# EAGLE design billdetector1c (EAGLE 5.11)
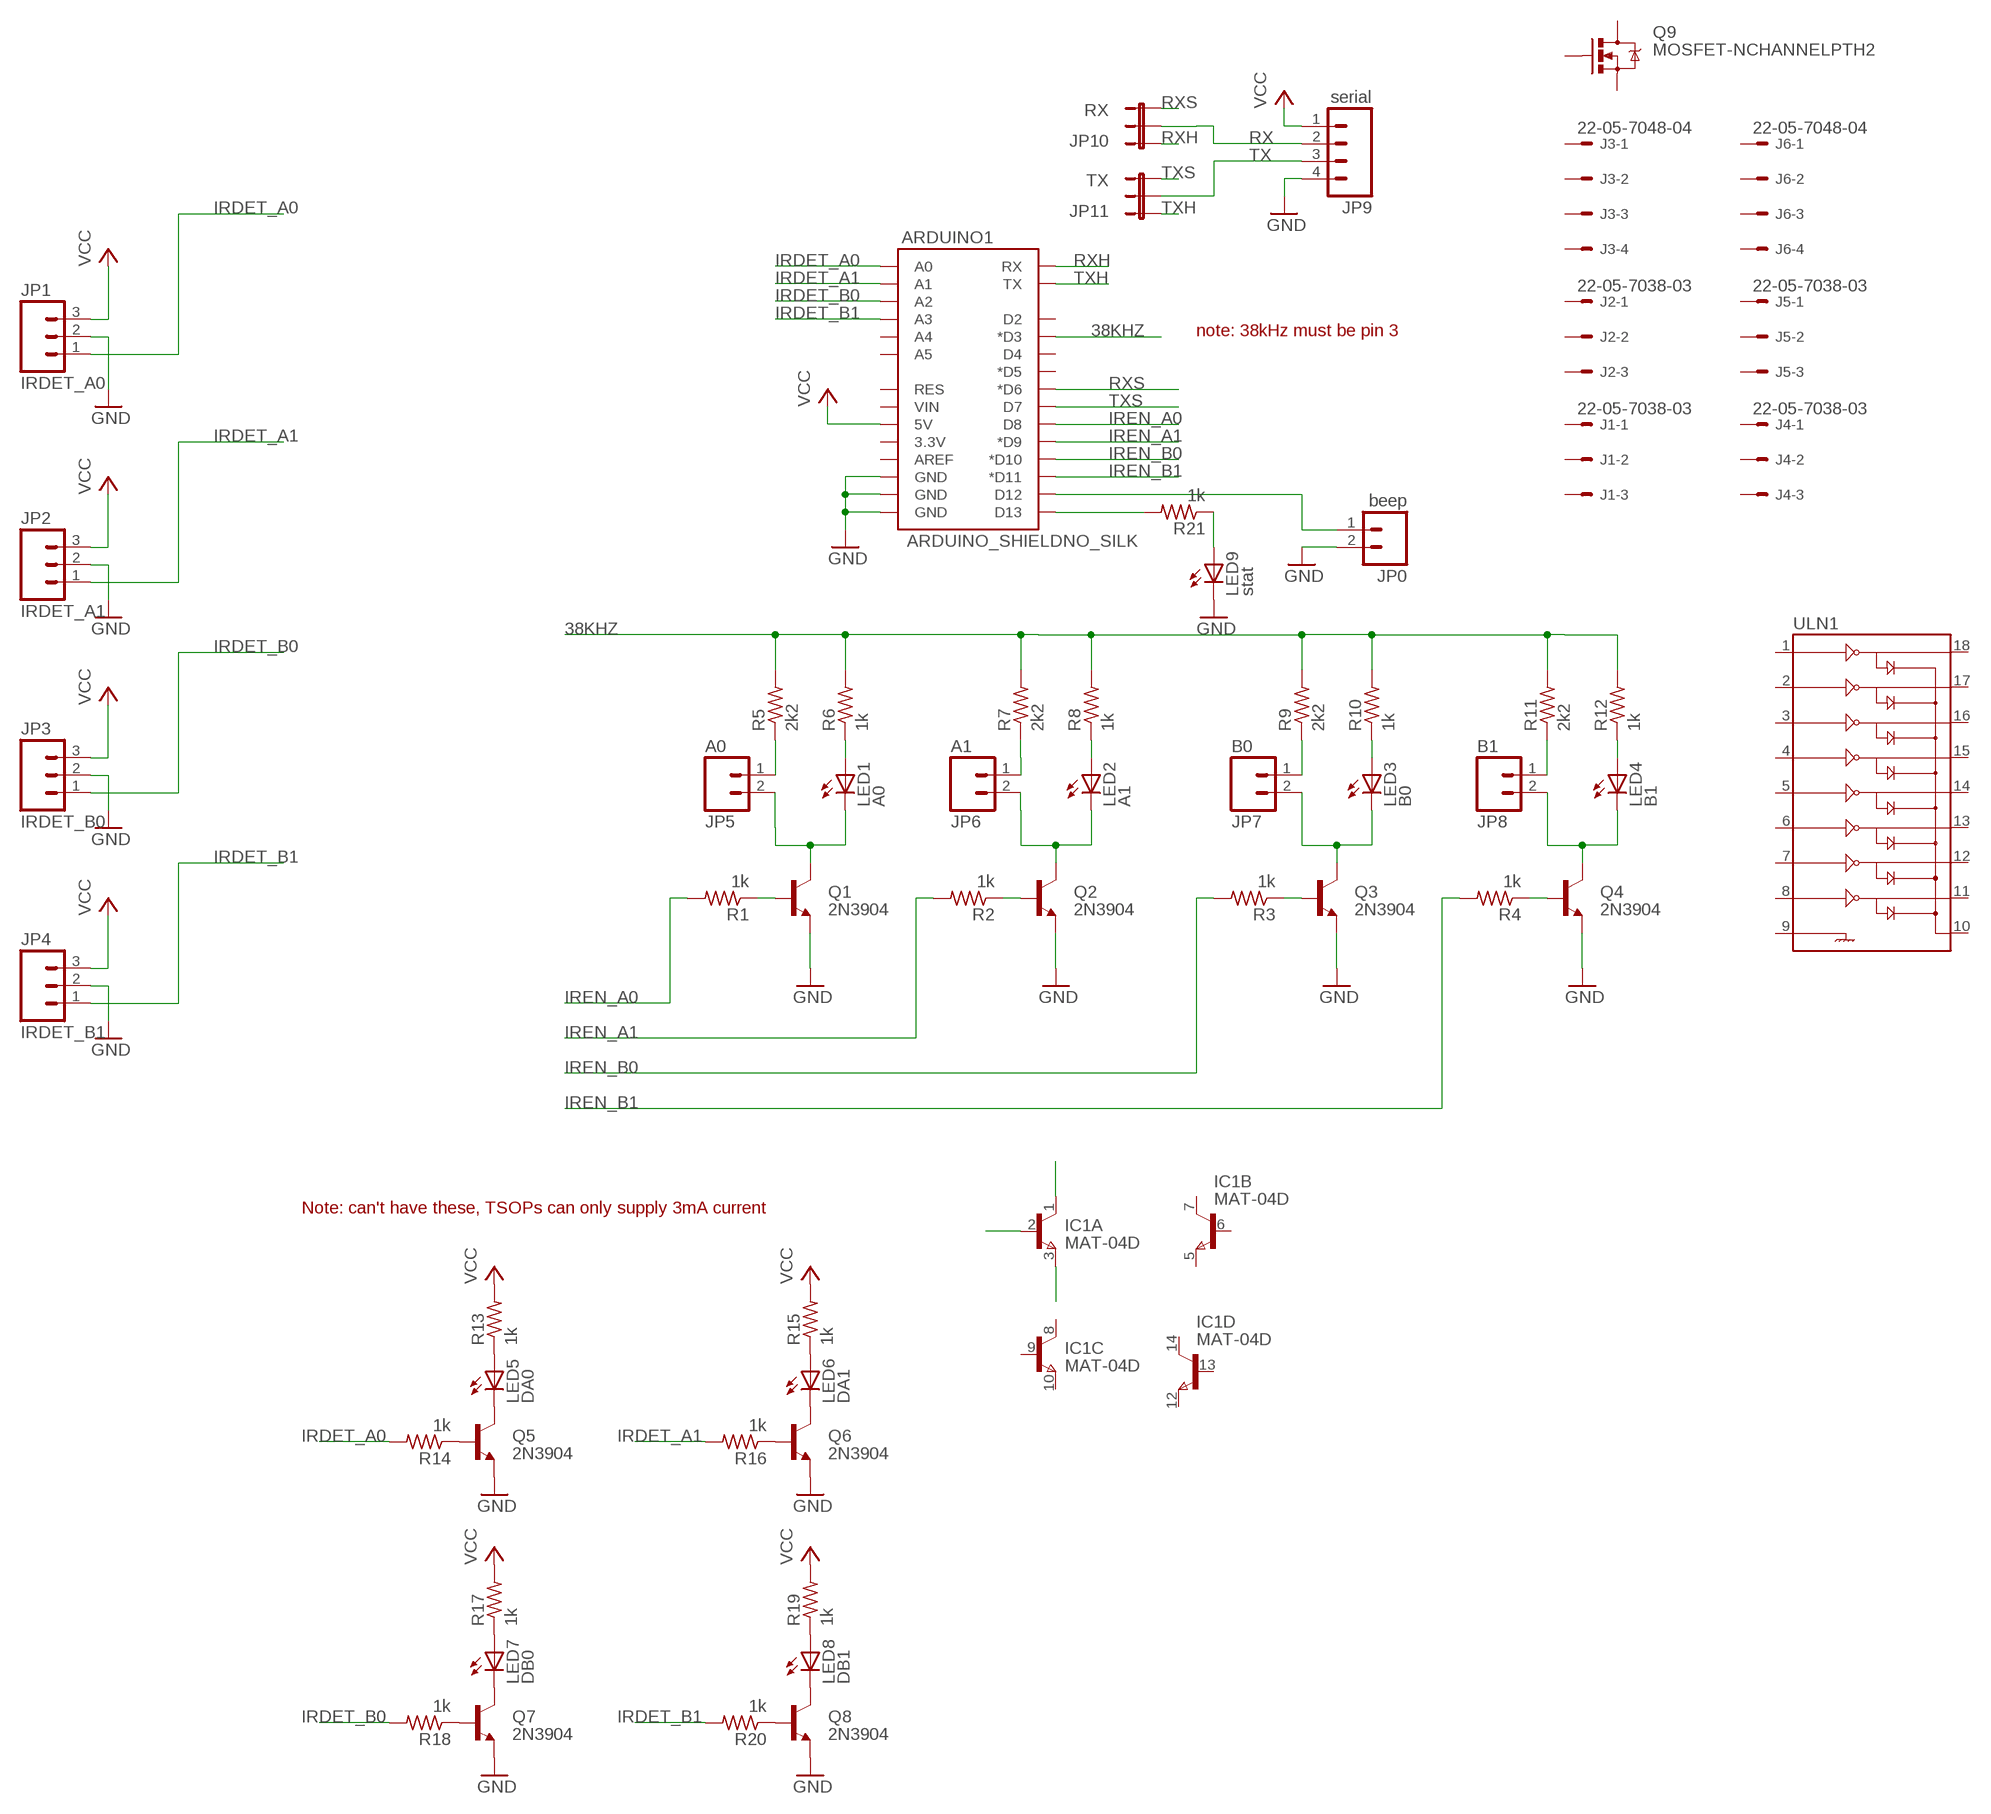
[diagram p0: schematic, sheet 1]

## Parts
ARDUINO1  ARDUINO_SHIELDNO_SILK  [DUEMILANOVE_VIAS]
IC1  MAT-04D  [SO14]
J1  22-05-7038-03  [7395-03]
J2  22-05-7038-03  [7395-03]
J3  22-05-7048-04  [7395-04]
J4  22-05-7038-03  [7395-03]
J5  22-05-7038-03  [7395-03]
J6  22-05-7048-04  [7395-04]
JP0  beep  M02LOCK  [1X02_LOCK]
JP1  IRDET_A0  M03POLAR_LOCK  [MOLEX-1X3_LOCK]
JP2  IRDET_A1  M03POLAR_LOCK  [MOLEX-1X3_LOCK]
JP3  IRDET_B0  M03POLAR_LOCK  [MOLEX-1X3_LOCK]
JP4  IRDET_B1  M03POLAR_LOCK  [MOLEX-1X3_LOCK]
JP5  A0  M02POLAR_LOCK  [MOLEX-1X2_LOCK]
JP6  A1  M02POLAR_LOCK  [MOLEX-1X2_LOCK]
JP7  B0  M02POLAR_LOCK  [MOLEX-1X2_LOCK]
JP8  B1  M02POLAR_LOCK  [MOLEX-1X2_LOCK]
JP9  serial  M04POLAR_LOCK  [MOLEX-1X4_LOCK]
JP10  RX  JUMPER-3PTH  [1X03]
JP11  TX  JUMPER-3PTH  [1X03]
LED1  A0  LED3MM  [LED3MM]
LED2  A1  LED3MM  [LED3MM]
LED3  B0  LED3MM  [LED3MM]
LED4  B1  LED3MM  [LED3MM]
LED5  DA0  LED3MM  [LED3MM]
LED6  DA1  LED3MM  [LED3MM]
LED7  DB0  LED3MM  [LED3MM]
LED8  DB1  LED3MM  [LED3MM]
LED9  stat  LED3MM  [LED3MM]
Q1  2N3904  TRANSISTOR_NPNTO92  [TO-92]
Q2  2N3904  TRANSISTOR_NPNTO92  [TO-92]
Q3  2N3904  TRANSISTOR_NPNTO92  [TO-92]
Q4  2N3904  TRANSISTOR_NPNTO92  [TO-92]
Q5  2N3904  TRANSISTOR_NPNTO92  [TO-92]
Q6  2N3904  TRANSISTOR_NPNTO92  [TO-92]
Q7  2N3904  TRANSISTOR_NPNTO92  [TO-92]
Q8  2N3904  TRANSISTOR_NPNTO92  [TO-92]
Q9  MOSFET-NCHANNELPTH2  [TO220V]
R1  1k  R-US_0204/5  [0204/5]
R2  1k  R-US_0204/5  [0204/5]
R3  1k  R-US_0204/5  [0204/5]
R4  1k  R-US_0204/5  [0204/5]
R5  2k2  R-US_0204/5  [0204/5]
R6  1k  R-US_0204/5  [0204/5]
R7  2k2  R-US_0204/5  [0204/5]
R8  1k  R-US_0204/5  [0204/5]
R9  2k2  R-US_0204/5  [0204/5]
R10  1k  R-US_0204/5  [0204/5]
R11  2k2  R-US_0204/5  [0204/5]
R12  1k  R-US_0204/5  [0204/5]
R13  1k  R-US_0204/5  [0204/5]
R14  1k  R-US_0204/5  [0204/5]
R15  1k  R-US_0204/5  [0204/5]
R16  1k  R-US_0204/5  [0204/5]
R17  1k  R-US_0204/5  [0204/5]
R18  1k  R-US_0204/5  [0204/5]
R19  1k  R-US_0204/5  [0204/5]
R20  1k  R-US_0204/5  [0204/5]
R21  1k  R-US_0204/5  [0204/5]
ULN1  ULN2803DIP  [DIL18]

## Nets
38KHZ: ARDUINO1.D3(*D3) R5.2 R6.2 R7.2 R8.2 R9.2 R10.2 R11.2 R12.2
GND: ARDUINO1.GND@0(GND) ARDUINO1.GND@1(GND) ARDUINO1.GND@2(GND) JP0.2 JP1.2 JP2.2 JP3.2 JP4.2 JP9.4 LED9.K(C) Q1.1(E) Q2.1(E) Q3.1(E) Q4.1(E) Q5.1(E) Q6.1(E) Q7.1(E) Q8.1(E)
IRDET_A0: ARDUINO1.A0 JP1.1 R14.2
IRDET_A1: ARDUINO1.A1 JP2.1 R16.2
IRDET_B0: ARDUINO1.A2 JP3.1 R18.2
IRDET_B1: ARDUINO1.A3 JP4.1 R20.2
IREN_A0: ARDUINO1.D8 R1.2
IREN_A1: ARDUINO1.D9(*D9) R2.2
IREN_B0: ARDUINO1.D10(*D10) R3.2
IREN_B1: ARDUINO1.D11(*D11) R4.2
N$1: Q3.2(B) R3.1
N$2: Q4.2(B) R4.1
N$3: JP6.1 R7.1
N$4: JP5.2 LED1.K(C) Q1.3(C)
N$5: Q1.2(B) R1.1
N$6: Q2.2(B) R2.1
N$7: ARDUINO1.D12 JP0.1
N$8: ARDUINO1.D13 R21.2
N$9: LED1.A R6.1
N$10: LED2.A R8.1
N$11: JP6.2 LED2.K(C) Q2.3(C)
N$12: LED5.A R13.1
N$13: JP5.1 R5.1
N$14: LED5.K(C) Q5.3(C)
N$15: LED3.A R10.1
N$16: LED4.A R12.1
N$17: JP7.1 R9.1
N$18: JP8.1 R11.1
N$19: JP7.2 LED3.K(C) Q3.3(C)
N$20: JP8.2 LED4.K(C) Q4.3(C)
N$21: Q5.2(B) R14.1
N$22: LED6.A R15.1
N$23: LED6.K(C) Q6.3(C)
N$24: Q6.2(B) R16.1
N$25: LED7.A R17.1
N$26: LED7.K(C) Q7.3(C)
N$27: Q7.2(B) R18.1
N$28: LED8.A R19.1
N$29: LED8.K(C) Q8.3(C)
N$30: Q8.2(B) R20.1
N$31: LED9.A R21.1
N$32: IC1.1(A:C)
N$33: IC1.2(A:B)
N$34: IC1.3(A:E)
RX: JP9.2 JP10.2
RXH: ARDUINO1.RX JP10.1
RXS: ARDUINO1.D6(*D6) JP10.3
TX: JP9.3 JP11.2
TXH: ARDUINO1.TX JP11.1
TXS: ARDUINO1.D7 JP11.3
VCC: ARDUINO1.5V JP1.3 JP2.3 JP3.3 JP4.3 JP9.1 R13.2 R15.2 R17.2 R19.2
Unconnected: ARDUINO1.3.3V ARDUINO1.A4 ARDUINO1.A5 ARDUINO1.AREF ARDUINO1.D2 ARDUINO1.D4 ARDUINO1.D5(*D5) ARDUINO1.RES ARDUINO1.VIN IC1.5(B:E) IC1.6(B:B) IC1.7(B:C) IC1.8(C:C) IC1.9(C:B) IC1.10(C:E) IC1.12(D:E) IC1.13(D:B) IC1.14(D:C) J1.1 J1.2 J1.3 J2.1 J2.2 J2.3 J3.1 J3.2 J3.3 J3.4 J4.1 J4.2 J4.3 J5.1 J5.2 J5.3 J6.1 J6.2 J6.3 J6.4 Q9.1(G) Q9.2(D) Q9.3(S) ULN1.1 ULN1.2 ULN1.3 ULN1.4 ULN1.5 ULN1.6 ULN1.7 ULN1.8 ULN1.9 ULN1.10 ULN1.11 ULN1.12 ULN1.13 ULN1.14 ULN1.15 ULN1.16 ULN1.17 ULN1.18

## Notes on the sheet
- note: 38kHz must be pin 3
- Note: can't have these, TSOPs can only supply 3mA current

## Library data of the parts
ARDUINO1 = SparkFun-20110517:ARDUINO_SHIELD
IC1 = linear:MAT-04: Quad TRANSISTOR
J1 J2 J4 J5 = con-molex:22-?-03: CONNECTOR wire to board 2.54 mm (.1 inch) pitch header; OC_FARNELL: unknown; OC_NEWARK: unknown
J3 J6 = con-molex:22-?-04: CONNECTOR wire to board 2.54 mm (.1 inch) pitch header; OC_FARNELL: unknown; OC_NEWARK: unknown
JP0 JP5-JP8 = SparkFun-20110517:M02: Header 2 Standard 2-pin 0.1" header. Use with straight break away headers (SKU : PRT-00116), right angle break away headers (PRT-00553), swiss pins (PRT-00743), machine pins (PRT-00117), and female headers (PRT-00115). Molex polarized connector foot print use with SKU : PRT-08233 with associated crimp pins and housings.
JP1-JP4 = SparkFun-20110517:M03: Header 3 Standard 3-pin 0.1" header. Use with straight break away headers (SKU : PRT-00116), right angle break away headers (PRT-00553), swiss pins (PRT-00743), machine pins (PRT-00117), and female headers (PRT-00115). Molex polarized connector foot print use with SKU : PRT-08232 with associated crimp pins and housings.
JP9 = SparkFun-20110517:M04: Header 4 Standard 4-pin 0.1" header. Use with straight break away headers (SKU : PRT-00116), right angle break away headers (PRT-00553), swiss pins (PRT-00743), machine pins (PRT-00117), and female headers (PRT-00115). Molex polarized connector foot print use with SKU : PRT-08231 with associated crimp pins and housings. 1MM SMD Version SKU: PRT-10208
JP10 JP11 = SparkFun-20110517:JUMPER-3
LED1-LED9 = SparkFun-20110517:LED: LEDs Standard schematic elements and footprints for 5mm, 3mm, 1206, and 0603 sized LEDs. 5mm - Spark Fun Electronics SKU : COM-00529 (and others)
Q1-Q8 = SparkFun-20110517:TRANSISTOR_NPN: Transistor NPN BJT configuration in SOT23 package. MMBT2222 is the common NPN we use. Double check BCE configuration again layout.
Q9 = SparkFun-20110517:MOSFET-NCHANNEL
R1-R21 = rcl:R-US_: RESISTOR, American symbol
ULN1 = SparkFun-20110517:ULN2803: Darlington Driver ULN2803 Darlington array. 500mA max per channel, 8-channel package. Spark Fun Electronics SKU : COM-00312

## Board
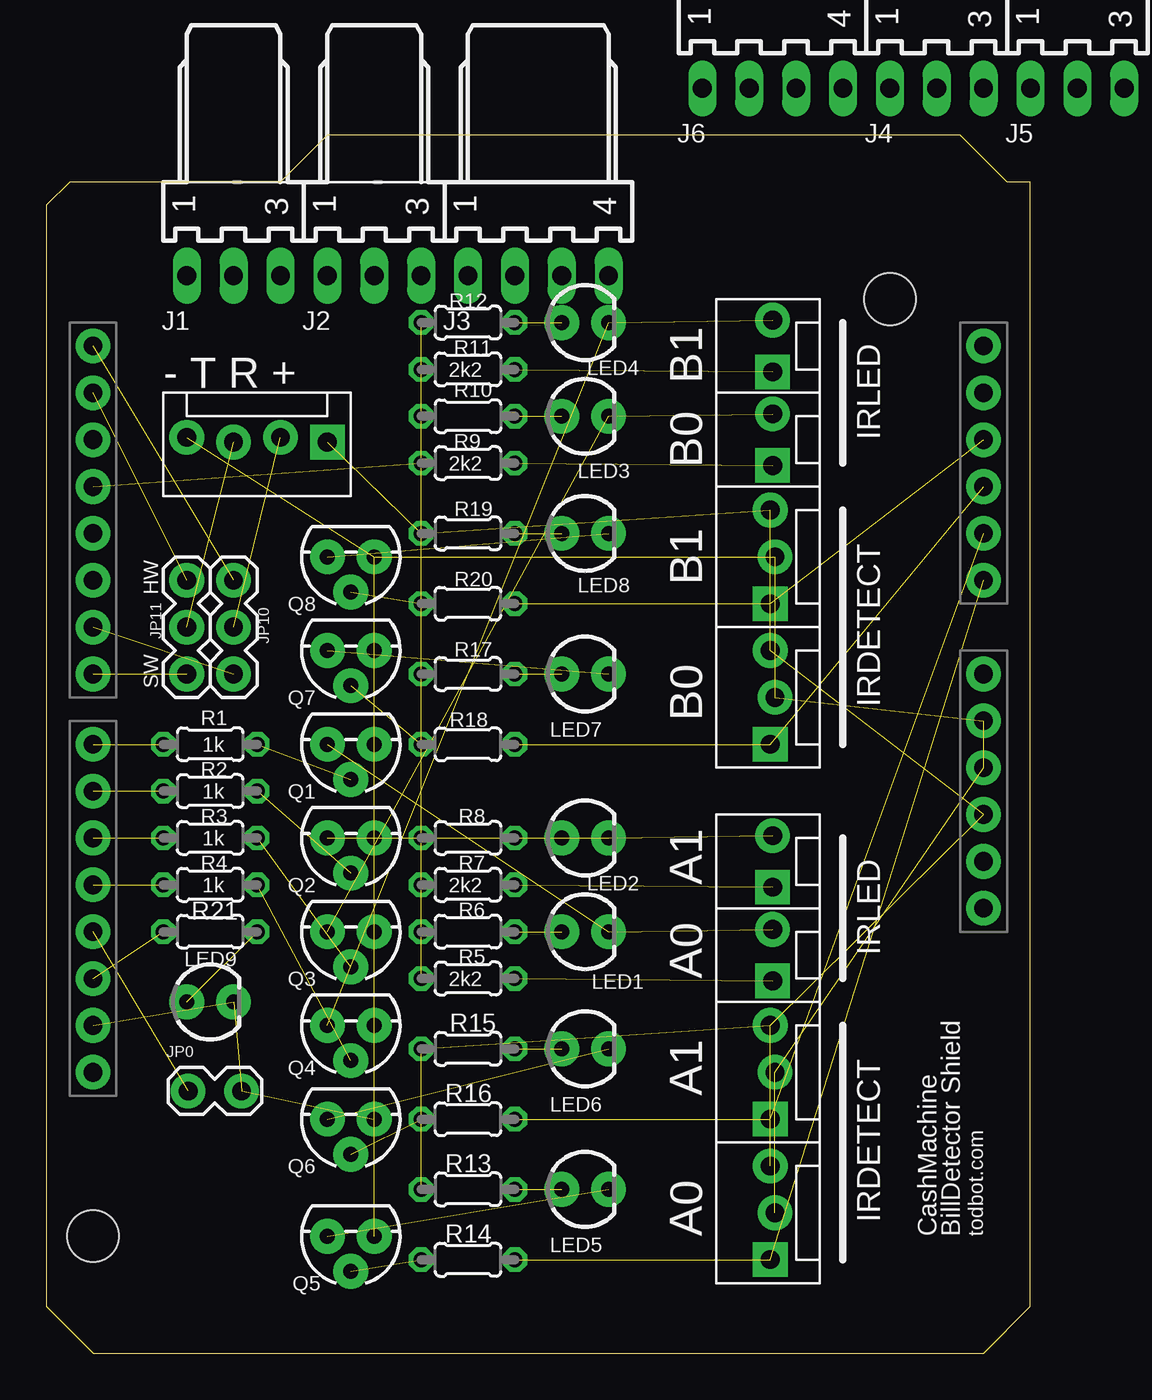
[diagram p1: board, top side]
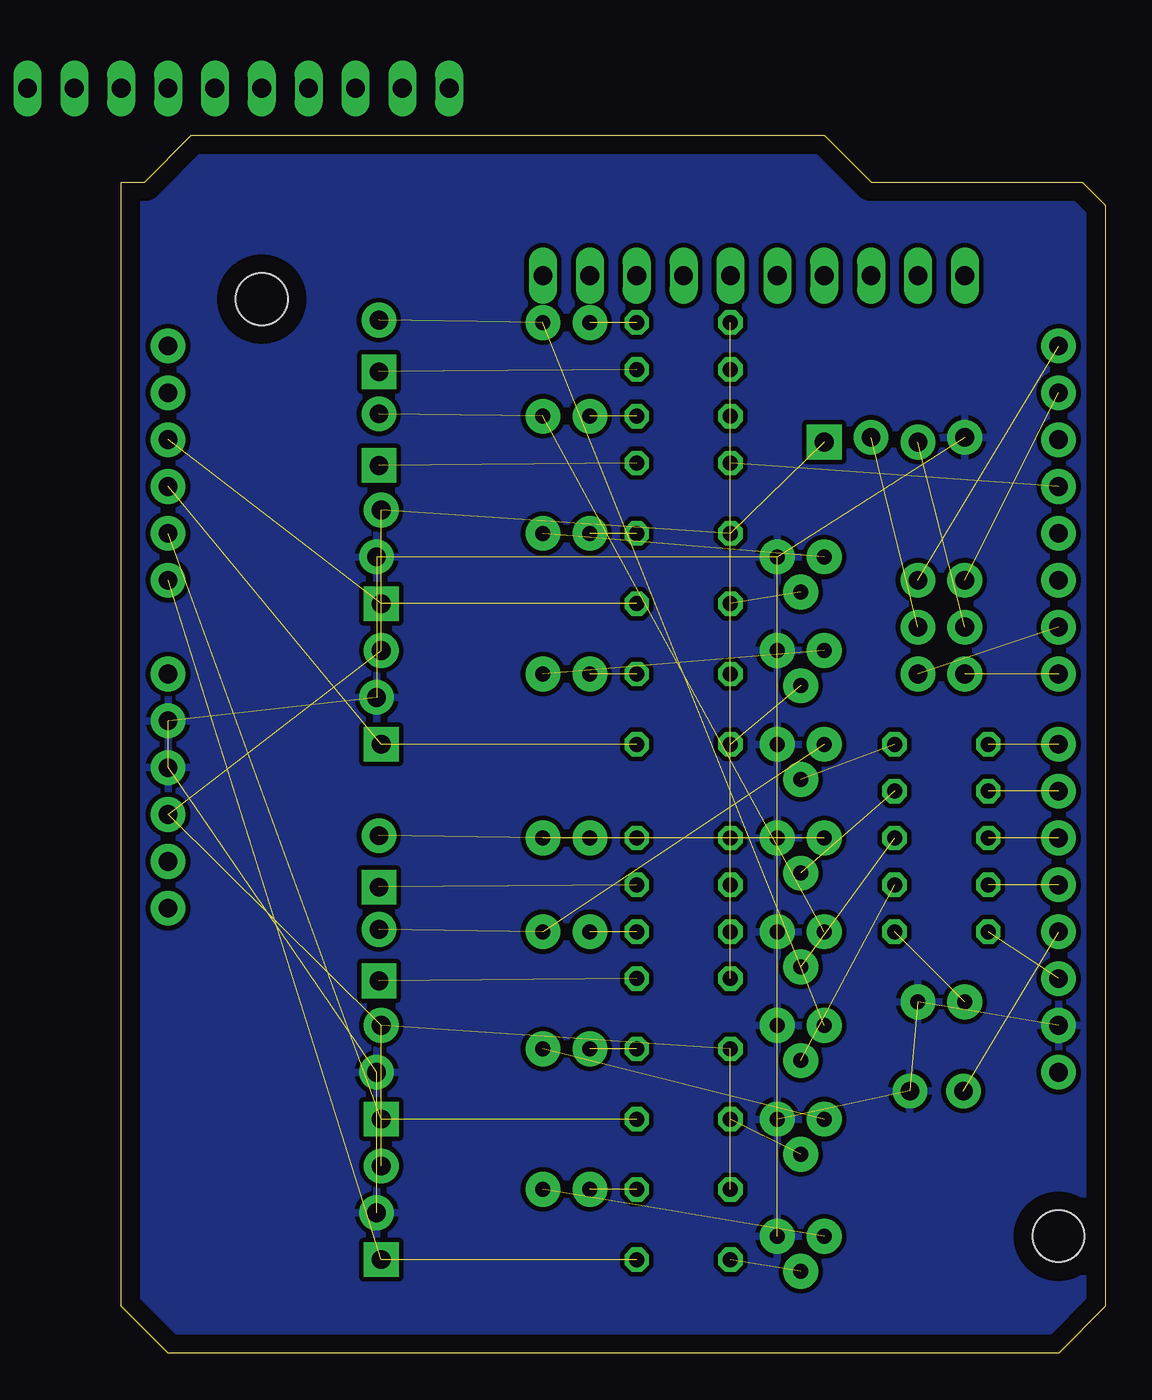
[diagram p2: board, bottom side, seen from below]

Size 53.34 x 66.04 mm. Coordinates in mm from the lower left corner, seen from the top.
Outline: 2.54,0 50.8,0 53.34,2.54 53.34,63.5 52.07,63.5 49.53,66.04 15.24,66.04 12.7,63.5 1.27,63.5 0,62.23 0,2.54 2.54,0
Copper layers (1*16): Top 0.035mm / dielectric 1.5mm / Bottom 0.035mm
Design rules "default *": minimum track width 10mil, minimum drill 24mil, track to track 10mil, track to pad 10mil, pad to pad 10mil, via to via 10mil, smd to smd 8mil, copper to edge 40mil, drill to drill 8mil, minimum pad ring 10mil, minimum via ring 8mil, stop-mask expansion 4mil, vias tented up to drill 0mil, thermal gap 10mil
Holes 2.8 mm at 45.72,57.15 2.54,6.35

### Footprints (pad centres in the part's own frame; a part is rotated, then mirrored left to right if it is on the bottom)
DUEMILANOVE_VIAS = drill 1.016 pad 1.88 round: 3.3V 50.8,13.97; 5V 50.8,16.51; A0 50.8,29.21; A1 50.8,31.75; A2 50.8,34.29; A3 50.8,36.83; A4 50.8,39.37; A5 50.8,41.91; AREF 2.54,2.54; D2 2.54,36.83; D3 2.54,34.29; D4 2.54,31.75; D5 2.54,29.21; D6 2.54,26.67; D7 2.54,24.13; D8 2.54,20.32; D9 2.54,17.78; D10 2.54,15.24; D11 2.54,12.7; D12 2.54,10.16; D13 2.54,7.62; GND@0 50.8,19.05; GND@1 50.8,21.59; GND@2 2.54,5.08; RES 50.8,11.43; RX 2.54,41.91; TX 2.54,39.37; VIN 50.8,24.13
SO14 = smd 0.6 x 2.2: 1 -3.81,-2.6; 2 -2.54,-2.6; 3 -1.27,-2.6; 4 0,-2.6; 5 1.27,-2.6; 6 2.54,-2.6; 7 3.81,-2.6; 8 3.81,2.6; 9 2.54,2.6; 10 1.27,2.6; 11 0,2.6; 12 -1.27,2.6; 13 -2.54,2.6; 14 -3.81,2.6
7395-03 = drill 1.016 long: 1 2.54,0; 2 0,0; 3 -2.54,0
7395-04 = drill 1.016 long: 1 3.81,0; 2 1.27,0; 3 -1.27,0; 4 -3.81,0
1X02_LOCK = drill 1.016 pad 1.88 round: 1 -0.178,0; 2 2.718,0
MOLEX-1X3_LOCK = drill 1.016 pad 1.88 square: 1 0,0.127 | drill 1.016 pad 1.88 round: 2 2.54,-0.127; 3 5.08,0.127
MOLEX-1X2_LOCK = drill 1.016 pad 1.88 square: 1 -0.127,0 | drill 1.016 pad 1.88 round: 2 2.667,0
MOLEX-1X4_LOCK = drill 1.016 pad 1.88 square: 1 0,0.127 | drill 1.016 pad 1.88 round: 2 2.54,-0.127; 3 5.08,0.127; 4 7.62,-0.127
1X03 = drill 1.016 pad 1.88 round: 1 0,0; 2 2.54,0; 3 5.08,0
LED3MM = drill 0.813 pad 1.88 round: A -1.27,0; K 1.27,0
TO-92 = drill 0.813 pad 1.88 round: 1 -1.27,0; 2 0,1.905; 3 1.27,0
TO220V = drill 1.016 long: 1 -2.54,0; 2 0,0; 3 2.54,0
0204/5 = drill 0.813 octagon: 1 -2.54,0; 2 2.54,0
DIL18 = drill 0.813 long: 1 -10.16,-3.81; 2 -7.62,-3.81; 3 -5.08,-3.81; 4 -2.54,-3.81; 5 0,-3.81; 6 2.54,-3.81; 7 5.08,-3.81; 8 7.62,-3.81; 9 10.16,-3.81; 10 10.16,3.81; 11 7.62,3.81; 12 5.08,3.81; 13 2.54,3.81; 14 0,3.81; 15 -2.54,3.81; 16 -5.08,3.81; 17 -7.62,3.81; 18 -10.16,3.81

### Placement (x,y rotation side)
ARDUINO1  0,12.7 0 top
IC1  71.12,46.99 90 top  (outside the outline)
J1  10.16,58.42 180 top
J2  17.78,58.42 180 top
J3  26.67,58.42 180 top
J4  48.26,68.58 180 top
J5  55.88,68.58 180 top
J6  39.37,68.58 180 top
JP0  7.87,14.22 0 top
JP1  39.37,5.08 90 top
JP2  39.37,12.7 90 top
JP3  39.37,33.02 90 top
JP4  39.37,40.64 90 top
JP5  39.37,20.32 90 top
JP6  39.37,25.4 90 top
JP7  39.37,48.26 90 top
JP8  39.37,53.34 90 top
JP9  15.24,49.53 180 top
JP10  10.16,41.91 270 top
JP11  7.62,41.91 270 top
LED1  29.21,22.86 0 top
LED2  29.21,27.94 0 top
LED3  29.21,50.8 0 top
LED4  29.21,55.88 0 top
LED5  29.21,8.89 0 top
LED6  29.21,16.51 0 top
LED7  29.21,36.83 0 top
LED8  29.21,44.45 0 top
LED9  8.89,19.05 0 top
Q1  16.51,33.02 180 top
Q2  16.51,27.94 180 top
Q3  16.51,22.86 180 top
Q4  16.51,17.78 180 top
Q5  16.51,6.35 180 top
Q6  16.51,12.7 180 top
Q7  16.51,38.1 180 top
Q8  16.51,43.18 180 top
Q9  78.74,73.66 0 top  (outside the outline)
R1  8.89,33.02 180 top
R2  8.89,30.48 180 top
R3  8.89,27.94 180 top
R4  8.89,25.4 180 top
R5  22.86,20.32 180 top
R6  22.86,22.86 180 top
R7  22.86,25.4 180 top
R8  22.86,27.94 180 top
R9  22.86,48.26 180 top
R10  22.86,50.8 180 top
R11  22.86,53.34 180 top
R12  22.86,55.88 180 top
R13  22.86,8.89 180 top
R14  22.86,5.08 0 top
R15  22.86,16.51 180 top
R16  22.86,12.7 0 top
R17  22.86,36.83 180 top
R18  22.86,33.02 0 top
R19  22.86,44.45 180 top
R20  22.86,40.64 0 top
R21  8.89,22.86 180 top
ULN1  67.31,27.94 270 top  (outside the outline)

### Tracks (layer width: path | path; a pad name or v marks a point on that pad's centre or on a via)
38KHZ  (8 unrouted)
GND  (17 unrouted)
  pour Bottom: 1.27,0 53.34,0 53.34,66.04 0,66.04
IRDET_A0  (2 unrouted)
IRDET_A1  (2 unrouted)
IRDET_B0  (2 unrouted)
IRDET_B1  (2 unrouted)
IREN_A0  (1 unrouted)
IREN_A1  (1 unrouted)
IREN_B0  (1 unrouted)
IREN_B1  (1 unrouted)
N$1  (1 unrouted)
N$2  (1 unrouted)
N$3  (1 unrouted)
N$4  (2 unrouted)
N$5  (1 unrouted)
N$6  (1 unrouted)
N$7  (1 unrouted)
N$8  (1 unrouted)
N$9  (1 unrouted)
N$10  (1 unrouted)
N$11  (2 unrouted)
N$12  (1 unrouted)
N$13  (1 unrouted)
N$14  (1 unrouted)
N$15  (1 unrouted)
N$16  (1 unrouted)
N$17  (1 unrouted)
N$18  (1 unrouted)
N$19  (2 unrouted)
N$20  (2 unrouted)
N$21  (1 unrouted)
N$22  (1 unrouted)
N$23  (1 unrouted)
N$24  (1 unrouted)
N$25  (1 unrouted)
N$26  (1 unrouted)
N$27  (1 unrouted)
N$28  (1 unrouted)
N$29  (1 unrouted)
N$30  (1 unrouted)
N$31  (1 unrouted)
RX  (1 unrouted)
RXH  (1 unrouted)
RXS  (1 unrouted)
TX  (1 unrouted)
TXH  (1 unrouted)
TXS  (1 unrouted)
VCC  (9 unrouted)

### Text on the board
tPlace: B1 | - T R + | IRLED | B0 | B1 | HW | SW | IRDETECT | B0 | A1 | IRLED | A0 | A1 | IRDETECT | A0 | CashMachine | BillDetector Shield | todbot.com